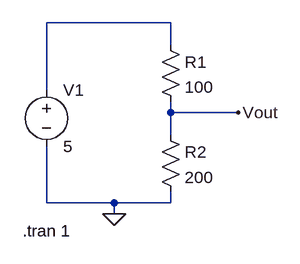
[diagram p0: schematic Draft1.asc]
Draft1.asc, the LTspice schematic file:
Version 4
SHEET 1 880 680
WIRE 320 16 144 16
WIRE 320 48 320 16
WIRE 144 112 144 16
WIRE 320 144 320 128
WIRE 416 144 320 144
WIRE 320 176 320 144
WIRE 144 272 144 192
WIRE 240 272 144 272
WIRE 320 272 320 256
WIRE 320 272 240 272
WIRE 240 288 240 272
FLAG 416 144 Vout
FLAG 240 288 0
SYMBOL voltage 144 96 R0
WINDOW 123 0 0 Left 0
WINDOW 39 0 0 Left 0
SYMATTR InstName V1
SYMATTR Value 5
SYMBOL res 304 32 R0
SYMATTR InstName R1
SYMATTR Value 100
SYMBOL res 304 160 R0
SYMATTR InstName R2
SYMATTR Value 200
TEXT 110 312 Left 2 !.tran 1

The netlist it stands for:
* Draft1.asc
V1 N001 0 5
R1 N001 Vout 100
R2 Vout 0 200
.tran 1
.backanno
.end